# Altium schematic sheet LED PD AB WH 3000149 (4F00227L_7P00500A)_2.SchDoc
size 449 x 281 mm
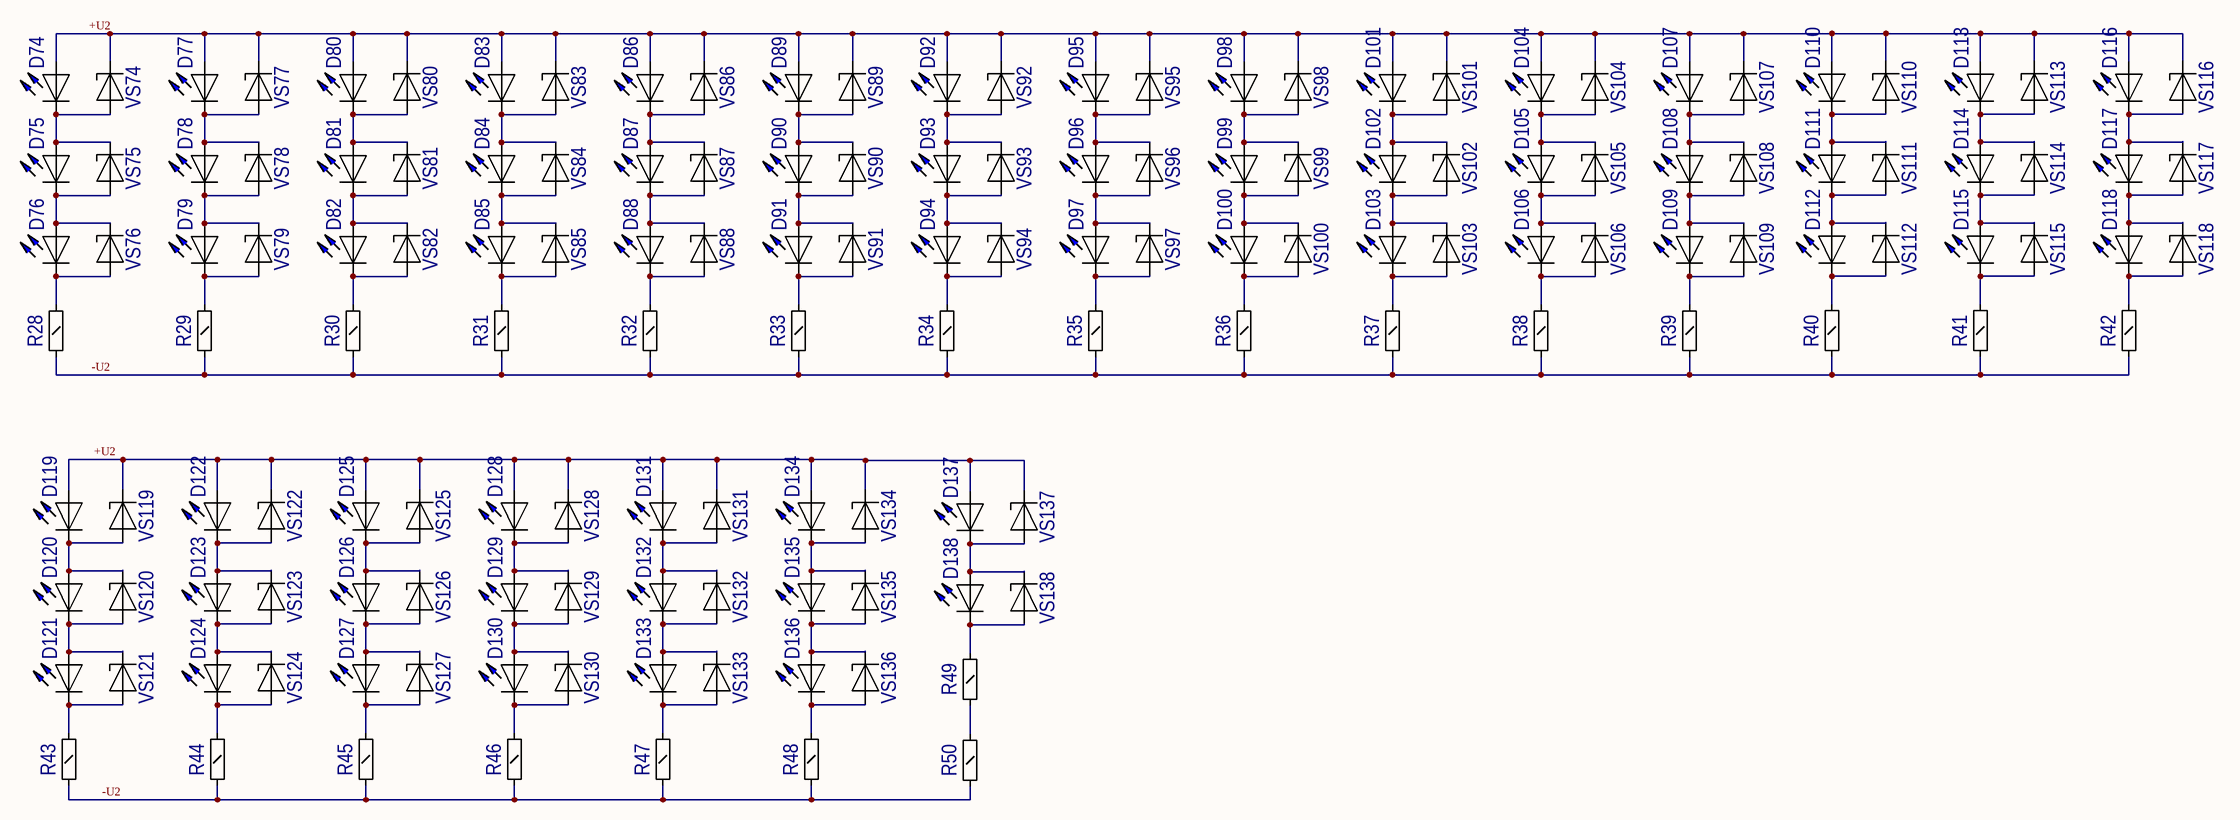
[diagram p0: LED PD AB WH 3000149 (4F00227L_7P00500A)_2.SchDoc]

## Parts
D74  LT_T66G  [T66G]  (value not drawn)
D75  LT_T66G  [T66G]  (value not drawn)
D76  LT_T66G  [T66G]  (value not drawn)
D77  LT_T66G  [T66G]  (value not drawn)
D78  LT_T66G  [T66G]  (value not drawn)
D79  LT_T66G  [T66G]  (value not drawn)
D80  LT_T66G  [T66G]  (value not drawn)
D81  LT_T66G  [T66G]  (value not drawn)
D82  LT_T66G  [T66G]  (value not drawn)
D83  LT_T66G  [T66G]  (value not drawn)
D84  LT_T66G  [T66G]  (value not drawn)
D85  LT_T66G  [T66G]  (value not drawn)
D86  LT_T66G  [T66G]  (value not drawn)
D87  LT_T66G  [T66G]  (value not drawn)
D88  LT_T66G  [T66G]  (value not drawn)
D89  LT_T66G  [T66G]  (value not drawn)
D90  LT_T66G  [T66G]  (value not drawn)
D91  LT_T66G  [T66G]  (value not drawn)
D92  LT_T66G  [T66G]  (value not drawn)
D93  LT_T66G  [T66G]  (value not drawn)
D94  LT_T66G  [T66G]  (value not drawn)
D95  LT_T66G  [T66G]  (value not drawn)
D96  LT_T66G  [T66G]  (value not drawn)
D97  LT_T66G  [T66G]  (value not drawn)
D98  LT_T66G  [T66G]  (value not drawn)
D99  LT_T66G  [T66G]  (value not drawn)
D100  LT_T66G  [T66G]  (value not drawn)
D101  LT_T66G  [T66G]  (value not drawn)
D102  LT_T66G  [T66G]  (value not drawn)
D103  LT_T66G  [T66G]  (value not drawn)
D104  LT_T66G  [T66G]  (value not drawn)
D105  LT_T66G  [T66G]  (value not drawn)
D106  LT_T66G  [T66G]  (value not drawn)
D107  LT_T66G  [T66G]  (value not drawn)
D108  LT_T66G  [T66G]  (value not drawn)
D109  LT_T66G  [T66G]  (value not drawn)
D110  LT_T66G  [T66G]  (value not drawn)
D111  LT_T66G  [T66G]  (value not drawn)
D112  LT_T66G  [T66G]  (value not drawn)
D113  LT_T66G  [T66G]  (value not drawn)
D114  LT_T66G  [T66G]  (value not drawn)
D115  LT_T66G  [T66G]  (value not drawn)
D116  LT_T66G  [T66G]  (value not drawn)
D117  LT_T66G  [T66G]  (value not drawn)
D118  LT_T66G  [T66G]  (value not drawn)
D119  LT_T66G  [T66G]  (value not drawn)
D120  LT_T66G  [T66G]  (value not drawn)
D121  LT_T66G  [T66G]  (value not drawn)
D122  LT_T66G  [T66G]  (value not drawn)
D123  LT_T66G  [T66G]  (value not drawn)
D124  LT_T66G  [T66G]  (value not drawn)
D125  LT_T66G  [T66G]  (value not drawn)
D126  LT_T66G  [T66G]  (value not drawn)
D127  LT_T66G  [T66G]  (value not drawn)
D128  LT_T66G  [T66G]  (value not drawn)
D129  LT_T66G  [T66G]  (value not drawn)
D130  LT_T66G  [T66G]  (value not drawn)
D131  LT_T66G  [T66G]  (value not drawn)
D132  LT_T66G  [T66G]  (value not drawn)
D133  LT_T66G  [T66G]  (value not drawn)
D134  LT_T66G  [T66G]  (value not drawn)
D135  LT_T66G  [T66G]  (value not drawn)
D136  LT_T66G  [T66G]  (value not drawn)
D137  LT_T66G  [T66G]  (value not drawn)
D138  LT_T66G  [T66G]  (value not drawn)
R28  R1206S  [RC1206S]  (value not drawn)
R29  R1206S  [RC1206S]  (value not drawn)
R30  R1206S  [RC1206S]  (value not drawn)
R31  R1206S  [RC1206S]  (value not drawn)
R32  R1206S  [RC1206S]  (value not drawn)
R33  R1206S  [RC1206S]  (value not drawn)
R34  R1206S  [RC1206S]  (value not drawn)
R35  R1206S  [RC1206S]  (value not drawn)
R36  R1206S  [RC1206S]  (value not drawn)
R37  R1206S  [RC1206S]  (value not drawn)
R38  R1206S  [RC1206S]  (value not drawn)
R39  R1206S  [RC1206S]  (value not drawn)
R40  R1206S  [RC1206S]  (value not drawn)
R41  R1206S  [RC1206S]  (value not drawn)
R42  R1206S  [RC1206S]  (value not drawn)
R43  R1206S  [RC1206S]  (value not drawn)
R44  R1206S  [RC1206S]  (value not drawn)
R45  R1206S  [RC1206S]  (value not drawn)
R46  R1206S  [RC1206S]  (value not drawn)
R47  R1206S  [RC1206S]  (value not drawn)
R48  R1206S  [RC1206S]  (value not drawn)
R49  R1206S  [RC1206S]  (value not drawn)
R50  R1206S  [RC1206S]  (value not drawn)
VS74  BZX84  [SOT23]  (value not drawn)
VS75  BZX84  [SOT23]  (value not drawn)
VS76  BZX84  [SOT23]  (value not drawn)
VS77  BZX84  [SOT23]  (value not drawn)
VS78  BZX84  [SOT23]  (value not drawn)
VS79  BZX84  [SOT23]  (value not drawn)
VS80  BZX84  [SOT23]  (value not drawn)
VS81  BZX84  [SOT23]  (value not drawn)
VS82  BZX84  [SOT23]  (value not drawn)
VS83  BZX84  [SOT23]  (value not drawn)
VS84  BZX84  [SOT23]  (value not drawn)
VS85  BZX84  [SOT23]  (value not drawn)
VS86  BZX84  [SOT23]  (value not drawn)
VS87  BZX84  [SOT23]  (value not drawn)
VS88  BZX84  [SOT23]  (value not drawn)
VS89  BZX84  [SOT23]  (value not drawn)
VS90  BZX84  [SOT23]  (value not drawn)
VS91  BZX84  [SOT23]  (value not drawn)
VS92  BZX84  [SOT23]  (value not drawn)
VS93  BZX84  [SOT23]  (value not drawn)
VS94  BZX84  [SOT23]  (value not drawn)
VS95  BZX84  [SOT23]  (value not drawn)
VS96  BZX84  [SOT23]  (value not drawn)
VS97  BZX84  [SOT23]  (value not drawn)
VS98  BZX84  [SOT23]  (value not drawn)
VS99  BZX84  [SOT23]  (value not drawn)
VS100  BZX84  [SOT23]  (value not drawn)
VS101  BZX84  [SOT23]  (value not drawn)
VS102  BZX84  [SOT23]  (value not drawn)
VS103  BZX84  [SOT23]  (value not drawn)
VS104  BZX84  [SOT23]  (value not drawn)
VS105  BZX84  [SOT23]  (value not drawn)
VS106  BZX84  [SOT23]  (value not drawn)
VS107  BZX84  [SOT23]  (value not drawn)
VS108  BZX84  [SOT23]  (value not drawn)
VS109  BZX84  [SOT23]  (value not drawn)
VS110  BZX84  [SOT23]  (value not drawn)
VS111  BZX84  [SOT23]  (value not drawn)
VS112  BZX84  [SOT23]  (value not drawn)
VS113  BZX84  [SOT23]  (value not drawn)
VS114  BZX84  [SOT23]  (value not drawn)
VS115  BZX84  [SOT23]  (value not drawn)
VS116  BZX84  [SOT23]  (value not drawn)
VS117  BZX84  [SOT23]  (value not drawn)
VS118  BZX84  [SOT23]  (value not drawn)
VS119  BZX84  [SOT23]  (value not drawn)
VS120  BZX84  [SOT23]  (value not drawn)
VS121  BZX84  [SOT23]  (value not drawn)
VS122  BZX84  [SOT23]  (value not drawn)
VS123  BZX84  [SOT23]  (value not drawn)
VS124  BZX84  [SOT23]  (value not drawn)
VS125  BZX84  [SOT23]  (value not drawn)
VS126  BZX84  [SOT23]  (value not drawn)
VS127  BZX84  [SOT23]  (value not drawn)
VS128  BZX84  [SOT23]  (value not drawn)
VS129  BZX84  [SOT23]  (value not drawn)
VS130  BZX84  [SOT23]  (value not drawn)
VS131  BZX84  [SOT23]  (value not drawn)
VS132  BZX84  [SOT23]  (value not drawn)
VS133  BZX84  [SOT23]  (value not drawn)
VS134  BZX84  [SOT23]  (value not drawn)
VS135  BZX84  [SOT23]  (value not drawn)
VS136  BZX84  [SOT23]  (value not drawn)
VS137  BZX84  [SOT23]  (value not drawn)
VS138  BZX84  [SOT23]  (value not drawn)

## Nets
+U2: D74.2 D77.2 D80.2 D83.2 D86.2 D89.2 D92.2 D95.2 D98.2 D101.2 D104.2 D107.2 D110.2 D113.2 D116.2 D119.2 D122.2 D125.2 D128.2 D131.2 D134.2 D137.2 VS74.3 VS77.3 VS80.3 VS83.3 VS86.3 VS89.3 VS92.3 VS95.3 VS98.3 VS101.3 VS104.3 VS107.3 VS110.3 VS113.3 VS116.3 VS119.3 VS122.3 VS125.3 VS128.3 VS131.3 VS134.3 VS137.3
-U2: R28.1 R29.1 R30.1 R31.1 R32.1 R33.1 R34.1 R35.1 R36.1 R37.1 R38.1 R39.1 R40.1 R41.1 R42.1 R43.1 R44.1 R45.1 R46.1 R47.1 R48.1 R50.1
NetD74_1: D74.1 D75.2 VS74.1 VS75.3
NetD75_1: D75.1 D76.2 VS75.1 VS76.3
NetD76_1: D76.1 R28.2 VS76.1
NetD77_1: D77.1 D78.2 VS77.1 VS78.3
NetD78_1: D78.1 D79.2 VS78.1 VS79.3
NetD79_1: D79.1 R29.2 VS79.1
NetD80_1: D80.1 D81.2 VS80.1 VS81.3
NetD81_1: D81.1 D82.2 VS81.1 VS82.3
NetD82_1: D82.1 R30.2 VS82.1
NetD83_1: D83.1 D84.2 VS83.1 VS84.3
NetD84_1: D84.1 D85.2 VS84.1 VS85.3
NetD85_1: D85.1 R31.2 VS85.1
NetD86_1: D86.1 D87.2 VS86.1 VS87.3
NetD87_1: D87.1 D88.2 VS87.1 VS88.3
NetD88_1: D88.1 R32.2 VS88.1
NetD89_1: D89.1 D90.2 VS89.1 VS90.3
NetD90_1: D90.1 D91.2 VS90.1 VS91.3
NetD91_1: D91.1 R33.2 VS91.1
NetD92_1: D92.1 D93.2 VS92.1 VS93.3
NetD93_1: D93.1 D94.2 VS93.1 VS94.3
NetD94_1: D94.1 R34.2 VS94.1
NetD95_1: D95.1 D96.2 VS95.1 VS96.3
NetD96_1: D96.1 D97.2 VS96.1 VS97.3
NetD97_1: D97.1 R35.2 VS97.1
NetD98_1: D98.1 D99.2 VS98.1 VS99.3
NetD99_1: D99.1 D100.2 VS99.1 VS100.3
NetD100_1: D100.1 R36.2 VS100.1
NetD101_1: D101.1 D102.2 VS101.1 VS102.3
NetD102_1: D102.1 D103.2 VS102.1 VS103.3
NetD103_1: D103.1 R37.2 VS103.1
NetD104_1: D104.1 D105.2 VS104.1 VS105.3
NetD105_1: D105.1 D106.2 VS105.1 VS106.3
NetD106_1: D106.1 R38.2 VS106.1
NetD107_1: D107.1 D108.2 VS107.1 VS108.3
NetD108_1: D108.1 D109.2 VS108.1 VS109.3
NetD109_1: D109.1 R39.2 VS109.1
NetD110_1: D110.1 D111.2 VS110.1 VS111.3
NetD111_1: D111.1 D112.2 VS111.1 VS112.3
NetD112_1: D112.1 R40.2 VS112.1
NetD113_1: D113.1 D114.2 VS113.1 VS114.3
NetD114_1: D114.1 D115.2 VS114.1 VS115.3
NetD115_1: D115.1 R41.2 VS115.1
NetD116_1: D116.1 D117.2 VS116.1 VS117.3
NetD117_1: D117.1 D118.2 VS117.1 VS118.3
NetD118_1: D118.1 R42.2 VS118.1
NetD119_1: D119.1 D120.2 VS119.1 VS120.3
NetD120_1: D120.1 D121.2 VS120.1 VS121.3
NetD121_1: D121.1 R43.2 VS121.1
NetD122_1: D122.1 D123.2 VS122.1 VS123.3
NetD123_1: D123.1 D124.2 VS123.1 VS124.3
NetD124_1: D124.1 R44.2 VS124.1
NetD125_1: D125.1 D126.2 VS125.1 VS126.3
NetD126_1: D126.1 D127.2 VS126.1 VS127.3
NetD127_1: D127.1 R45.2 VS127.1
NetD128_1: D128.1 D129.2 VS128.1 VS129.3
NetD129_1: D129.1 D130.2 VS129.1 VS130.3
NetD130_1: D130.1 R46.2 VS130.1
NetD131_1: D131.1 D132.2 VS131.1 VS132.3
NetD132_1: D132.1 D133.2 VS132.1 VS133.3
NetD133_1: D133.1 R47.2 VS133.1
NetD134_1: D134.1 D135.2 VS134.1 VS135.3
NetD135_1: D135.1 D136.2 VS135.1 VS136.3
NetD136_1: D136.1 R48.2 VS136.1
NetD137_1: D137.1 D138.2 VS137.1 VS138.3
NetD138_1: D138.1 R49.2 VS138.1
NetR49_1: R49.1 R50.2

Not connected (* = marked no-connect by the designer): VS74 2; VS75 2; VS76 2; VS77 2; VS78 2; VS79 2; VS80 2; VS81 2; VS82 2; VS83 2; VS84 2; VS85 2; VS86 2; VS87 2; VS88 2; VS89 2; VS90 2; VS91 2; VS92 2; VS93 2; VS94 2; VS95 2; VS96 2; VS97 2; VS98 2; VS99 2; VS100 2; VS101 2; VS102 2; VS103 2; VS104 2; VS105 2; VS106 2; VS107 2; VS108 2; VS109 2; VS110 2; VS111 2; VS112 2; VS113 2; VS114 2; VS115 2; VS116 2; VS117 2; VS118 2; VS119 2; VS120 2; VS121 2; VS122 2; VS123 2; VS124 2; VS125 2; VS126 2; VS127 2; VS128 2; VS129 2; VS130 2; VS131 2; VS132 2; VS133 2; VS134 2; VS135 2; VS136 2; VS137 2; VS138 2

## Library data of the parts
D74-D138 = LT_T66G: {Description}
R28-R48 R50 = R1206S: Value: Pos.20
R49 = R1206S: Value: Pos.22
VS74-VS138 = BZX84: OriginalName: DIODE; Value: *